# Altium schematic sheet SAMD21.SchDoc
size A3; SheetNumber: 1; SheetTotal: 3
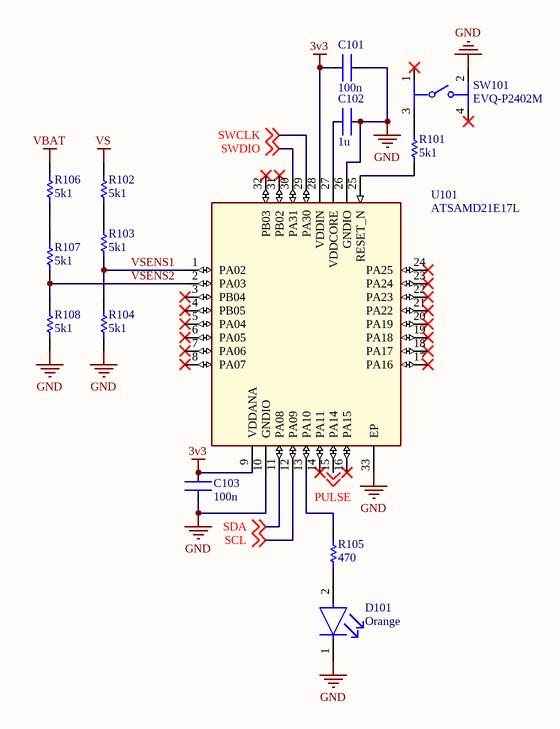
[diagram p0: SAMD21.SchDoc]

## Parts
C101  100n  [FP-GCM155-0_05-MFG]
C102  1u  [FP-GRM155-0_1-MFG]
C103  100n  [FP-GCM155-0_05-MFG]
D101  Orange  [FP-SML-P1-MFG]
R101  5k1  [RESC1005X04N]
R102  5k1  [RESC1005X04N]
R103  5k1  [RESC1005X04N]
R104  5k1  [RESC1005X04N]
R105  470  [RESC1005X04N]
R106  5k1  [RESC1005X04N]
R107  5k1  [RESC1005X04N]
R108  5k1  [RESC1005X04N]
SW101  EVQ-P2402M  [EVQ-P2402M]
U101  ATSAMD21E17L  [QFN50P500X500X100_HS-33L]

## Nets
3v3: C101.1 C103.2 U101.9(VDDANA) U101.28(VDDIN)
GND: C101.2 C102.2 C103.1 D101.1(C) R104.1 R108.1 SW101.2 U101.10(GNDIO) U101.26(GNDIO) U101.33(EP)
VBAT: R106.2
VS: R102.2
PULSE: U101.15(PA14) ; off-sheet PULSE
SCL: U101.12(PA09) ; off-sheet SCL
SDA: U101.11(PA08) ; off-sheet SDA
SWCLK: U101.29(PA30) ; off-sheet SWCLK
SWDIO: U101.30(PA31) ; off-sheet SWDIO
VSENS1: R103.1 R104.2 U101.1(PA02)
VSENS2: R107.1 R108.2 U101.2(PA03)
NetC102_1: C102.1 U101.27(VDDCORE)
NetD101_2: D101.2(A) R105.2
NetR101_1: R101.1 SW101.3
NetR101_2: R101.2 U101.25(RESET_N)
NetR102_1: R102.1 R103.2
NetR105_1: R105.1 U101.13(PA10)
NetR106_1: R106.1 R107.2

Not connected (* = marked no-connect by the designer): SW101 1* 4*; U101 3(PB04)* 4(PB05)* 5(PA04)* 6(PA05)* 7(PA06)* 8(PA07)* 14(PA11)* 16(PA15)* 17(PA16)* 18(PA17)* 19(PA18)* 20(PA19)* 21(PA22)* 22(PA23)* 23(PA24)* 24(PA25)* 31(PB02)* 32(PB03)*

## Library data of the parts
C101 C103 = GCM155R71H104KE02J: Ceramic Capacitor for Automotive 100nF ±10% 50VDC X7R 0402 Paper T/R; Voltage Rating (DC): 50V; Case Code (Metric): 1005; Dielectric: X7R; Capacitance: 100nF; Packaging: Tape and Reel; Min Operating Temperature: -55°C; Length: 0.039inch; Thickness: 0.022inch; Height: 0.5mm; Mount: Surface Mount; Termination: SMD/SMT; Voltage Rating: 50V; Package Quantity: 50000; Width: 0.02inch; Case/Package: 0402; Case Code (Imperial): 0402; Ratings: AEC-Q200; Max Operating Temperature: 125°C; Tolerance: 10%; Weight: 0.000212oz; Supplier 1: Digi-Key; Supplier Part Number 1: 490-14514-1-ND
C102 = GRM155R61H105ME05D: Chip Multilayer Ceramic Capacitors for General Purpose, 0402, 1.0uF, X5R, 15%, 20%, 50V; Supplier 1: Digi-Key; Supplier Part Number 1: 490-GRM155R61H105ME05DTR-ND
D101 = SML-P11DTT86R: LED ORANGE CLEAR 1006 SMD; Manufacturer: Rohm; Forward Current: 1mA; Wavelength: 605nm; Reverse Voltage: 5V; Power Dissipation: 52mW; Led Orientation: Top View; Luminous Intensity: 7.3mcd; Forward Voltage: 1.9V; Mouser Description: LED Uni-Color Orange 2-Pin Chip 0402(1006Metric) T/R; RoHS: TRUE; Temperature: -40°C to +85°C; Package: SML-P11; Manufacturer Part Number: SML-P11DTT86R; Automotive: No; Digikey Description: LED ORANGE CLEAR 1006 SMD; Lead Free: Yes; Octopart: https://octopart.com/sml-p11dtt86r-rohm-34112313; Temperature Range Low: -40°C; Device Class L2: LEDs; Device Class L3: unset; Height: 0.25mm; Temperature Range High: +85°C; Device Class L1: Optoelectronics; ComponentLink2URL: https://d1d2qsbl8m0m72.cloudfront.net/en/products/databook/datasheet/opto/led/chip_mono/sml-p11-e.pdf; Colour: Orange; Category: Diode; ComponentLink2Description: Datasheet; Supplier 1: Digi-Key; Supplier Part Number 1: SML-P11DTT86RCT-ND
R101-R104 R106-R108 = ERJ-U02J512X: Manufacturer: Panasonic; Part Number: ERJ2RKF27R0X; Supplier 1: Mouser; Supplier Part Number 1: 667-ERJ-U02J512X
R105 = ERJ-U02J471X: Manufacturer: Panasonic; Part Number: ERJ2RKF27R0X; Supplier 1: Digi-Key; Supplier Part Number 1: 10-ERJ-U02J471XCT-ND
SW101 = EVQ-P2402M: Supplier 1: Digi-Key; Supplier Part Number 1: P11080SCT-ND
U101 = ATSAMD21E17L: Supplier 1: Arrow Electronics; Supplier Part Number 1: ATSAMD21E17L-MNT